# Altium schematic sheet etna-sch-ui.SchDoc
size A4; SheetNumber: 6; SheetTotal: 6; PageSetup: Record=PageOptions|CenterHorizontal=True|CenterVertical=True|PrintScale=0.73|XCorrection=1.00|YCorrection=1.00|PrintKind=1|BorderSize=5000000|LeftOffset=0|BottomOffset=0|Orientation=2|PaperLength=1000|PaperWidth=1000|Scale=100|PaperSource=15|PrintQuality=1200|MediaType=1|DitherType=10|PaperKind=A4|PrintScaleMode=1
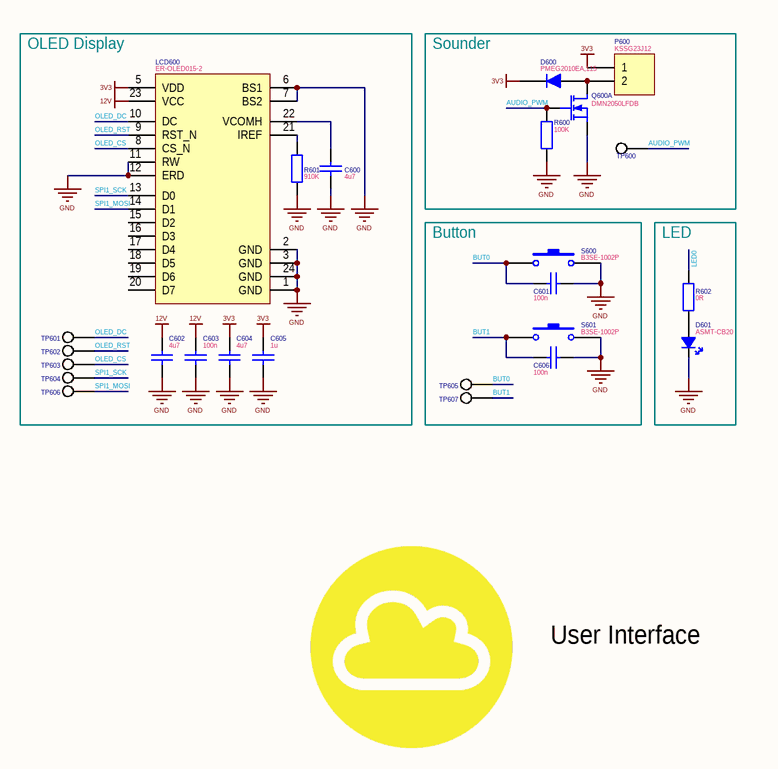
[diagram p0: etna-sch-ui.SchDoc]

## Parts
C600  4u7  [0603-capacitor]
C601  100n  [0402-capacitor]
C602  4u7  [0603-capacitor]
C603  100n  [0603-capacitor]
C604  4u7  [0603-capacitor]
C605  1u  [0603-capacitor]
C606  100n  [0402-capacitor]
D600  PMEG2010EA,115  [SOD-323]
D601  ASMT-CB20  [0603-LED]
LCD600  ER-OLED015-2  [XF2M-2415-1A-REV]
P600  KSSG23J12  [KSSG23J12]
Q600  DMN2050LFDB  [U-DFN2020-6]  (part A of 2)
R600  100K  [0402-resistor]
R601  910K  [0402-resistor]
R602  0R  [0402-resistor]
S600  B3SE-1002P  [B3SE-1002P]
S601  B3SE-1002P  [B3SE-1002P]
TP600  TP  [TESTPOINT]  (value not drawn)
TP601  TP  [TESTPOINT]  (value not drawn)
TP602  TP  [TESTPOINT]  (value not drawn)
TP603  TP  [TESTPOINT]  (value not drawn)
TP604  TP  [TESTPOINT]  (value not drawn)
TP605  TP  [TESTPOINT]  (value not drawn)
TP606  TP  [TESTPOINT]  (value not drawn)
TP607  TP  [TESTPOINT]  (value not drawn)

## Blocks framed on the sheet
OLED Display: C600 C602-C605 LCD600 R601 TP601-TP604 TP606
Sounder: D600 P600 Q600 R600 TP600
Button: C601 C606 S600 S601 TP605 TP607
LED: D601 R602

## Nets
3V3: C604.1 C605.1 D600.2(K) LCD600.5(VDD) P600.1
12V: C602.1 C603.1 LCD600.23(VCC)
GND: C600.2 C601.1 C602.2 C603.2 C604.2 C605.2 C606.1 D601.2(K) LCD600.1(GND) LCD600.2(GND) LCD600.3(GND) LCD600.6(BS1) LCD600.7(BS2) LCD600.11(RW) LCD600.12(ERD) LCD600.24(GND) Q600.S1 R600.1 R601.1 S600.1 S601.1
AUDIO_PWM: Q600.G1 R600.2 TP600.1(GND)
BUT0: C601.2 S600.2 TP605.1(GND)
BUT1: C606.2 S601.2 TP607.1(GND)
LED0: R602.2
OLED_CS: LCD600.8(CS_N) TP603.1(GND)
OLED_DC: LCD600.10(DC) TP601.1(GND)
OLED_RST: LCD600.9(RST_N) TP602.1(GND)
SPI1_MOSI: LCD600.14(D1) TP606.1(GND)
SPI1_SCK: LCD600.13(D0) TP604.1(GND)
NetC600_1: C600.1 LCD600.22(VCOMH)
NetD600_1: D600.1(A) P600.2 Q600.D1
NetD601_1: D601.1(A) R602.1
NetLCD600_21: LCD600.21(IREF) R601.2

Not connected (* = marked no-connect by the designer): LCD600 4(NC) 15(D2) 16(D3) 17(D4) 18(D5) 19(D6) 20(D7)

## Notes on the sheet
- User Interface

## Library data of the parts
C600-C606 = CAP: Capacitor
D600 = DIODE: Published: 8-Jun-2000; LatestRevisionDate: 17-Jul-2002; LatestRevisionNote: Re-released for DXP Platform.; PackageVersion: Sep-1996; PackageReference: SMC; Publisher: Altium Limited; PackageDescription: DO-214-AB/SMC; 2 C-Bend Leads; Body 7.9 x 5.9 mm, inc. leads (LxW); Code_JEDEC: DO-214-AB
D601 = LED: Published: 8-Jun-2000; LatestRevisionDate: 17-Jul-2002; LatestRevisionNote: Re-released for DXP Platform.; PackageVersion: Sep-1996; PackageReference: SMC; Publisher: Altium Limited; PackageDescription: DO-214-AB/SMC; 2 C-Bend Leads; Body 7.9 x 5.9 mm, inc. leads (LxW); Code_JEDEC: DO-214-AB
LCD600 = ER-OLED015-2: I2C 1.5"OLED Display Serial 128x64 Module,SSD1309,White on Black
P600 = Header 2: Header, 2-Pin; LatestRevisionDate: 17-Jul-2002; LatestRevisionNote: Re-released for DXP Platform.; Publisher: Altium Limited
Q600 = DMN2050LFDB: 20 V, 800 mA dual N-channel Trench MOSFET
R600-R602 = RES: Resistor
S600 S601 = SW-PB: Switch; Published: 24-Mar-1999; LatestRevisionDate: 17-Jul-2002; LatestRevisionNote: Re-released for DXP Platform.; PackageReference: SPST-2; Publisher: Altium Limited; PackageDescription: Switch; 2 Leads
TP600-TP607 = TEST_POINT